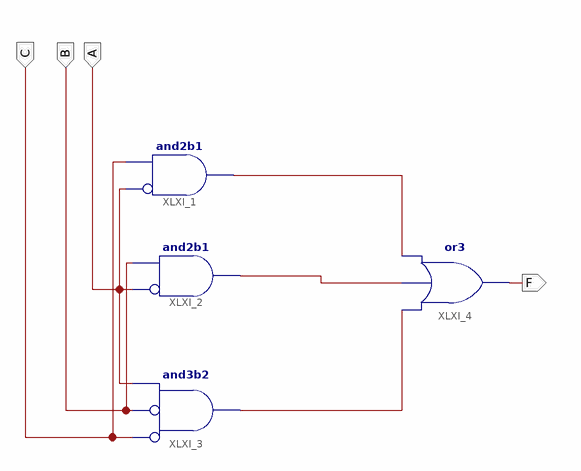
[diagram p0: schematic sheet 1]
// Xilinx ISE schematic bullshit.sch (spartan3e) as structural Verilog: 4 symbols, 4 ports
module bullshit (
  input  A,
  input  B,
  input  C,
  output F
);

  wire XLXN_1, XLXN_2, XLXN_3;

  and XLXI_1 (XLXN_1, ~A, C);  // and2b1
  and XLXI_2 (XLXN_2, ~A, B);  // and2b1
  and XLXI_3 (XLXN_3, ~C, ~B, A);  // and3b2
  or XLXI_4 (F, XLXN_3, XLXN_2, XLXN_1);
endmodule
